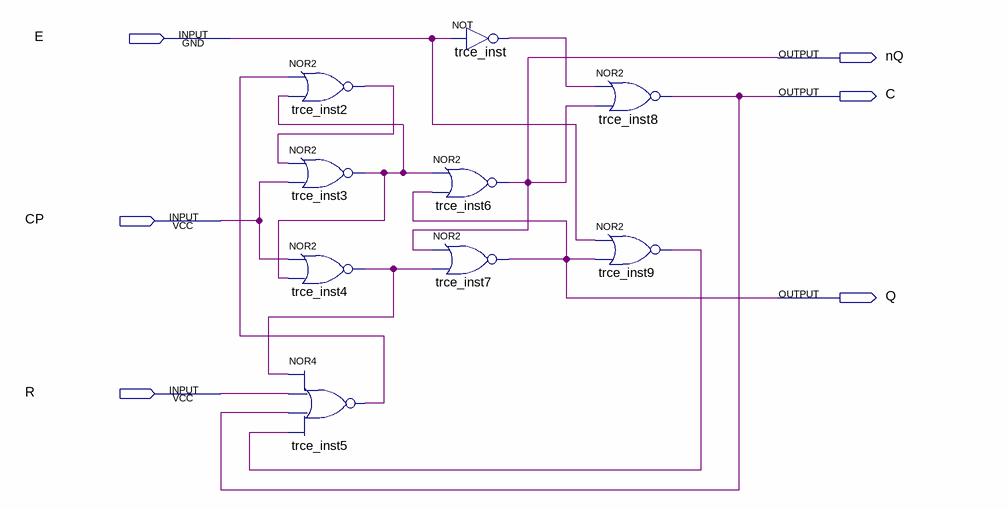
[diagram p0: schematic sheet]
// Quartus schematic TRCE.bdf as structural Verilog: 9 symbols, 6 pins
module TRCE (
  input  E,
  input  CP,
  input  R,
  output nQ,
  output C,
  output Q
);

  wire trce_inst2_out, trce_inst3_out, trce_inst4_out, trce_inst5_out, trce_inst9_out, trce_inst_out;

  nor trce_inst2 (trce_inst2_out, trce_inst5_out, trce_inst3_out);
  nor trce_inst3 (trce_inst3_out, trce_inst2_out, CP);
  nor trce_inst4 (trce_inst4_out, CP, trce_inst3_out);
  nor trce_inst5 (trce_inst5_out, trce_inst4_out, R, C, trce_inst9_out);
  not trce_inst (trce_inst_out, E);
  nor trce_inst6 (nQ, trce_inst3_out, Q);
  nor trce_inst7 (Q, nQ, trce_inst4_out);
  nor trce_inst8 (C, trce_inst_out, nQ);
  nor trce_inst9 (trce_inst9_out, E, Q);
endmodule
